# EAGLE design Bell003 (EAGLE 7.3.0)
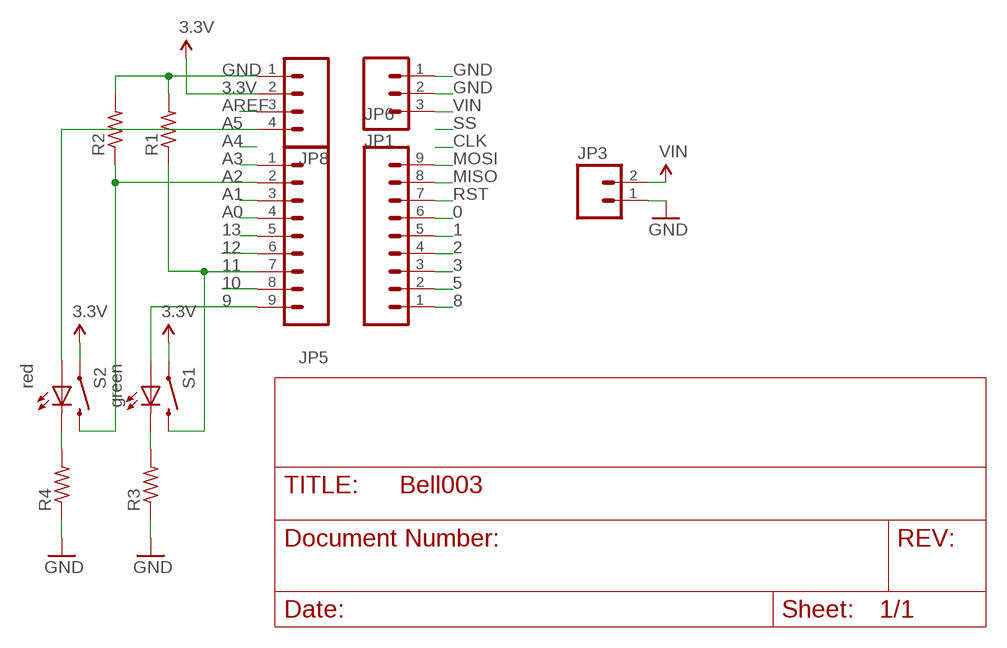
[diagram p0: schematic, sheet 1]

## Parts
JP1  M03PTH  [1X03]
JP3  M02-JST-2-PTH-NO_SILK  [JST-2-PTH-NS]
JP5  M09  [1X09]
JP6  M09  [1X09]
JP8  M04PTH  [1X04]
R1  RES-US1206FAB  [R1206FAB]
R2  RES-US1206FAB  [R1206FAB]
R3  RES-US1206FAB  [R1206FAB]
R4  RES-US1206FAB  [R1206FAB]
S1  green  SWITCH-MOMENTARY-LEDPTH  [TACTILE-PTH-LED-12MM]
S2  red  SWITCH-MOMENTARY-LEDPTH  [TACTILE-PTH-LED-12MM]

## Nets
0: JP6.6
1: JP6.5
2: JP6.4
3: JP6.3
3.3V: JP8.2 S1.4 S2.4
5: JP6.2
8: JP6.1
9: JP5.9 S1.A
10: JP5.8
11: JP5.7 R1.1 S1.2
12: JP5.6
13: JP5.5
A0: JP5.4
A1: JP5.3
A2: JP5.2 R2.1 S2.2
A3: JP5.1
A5: JP8.4 S2.A
AREF: JP8.3
GND: JP1.1 JP1.2 JP3.1 JP8.1 R1.2 R2.2 R3.1 R4.1
MISO: JP6.8
MOSI: JP6.9
N$4: R3.2 S1.C
N$5: R4.2 S2.C
RST: JP6.7
VIN: JP1.3 JP3.2

## Library data of the parts
JP1 = SparkFun-Connectors:M03: Header 3 Standard 3-pin 0.1" header. Use with straight break away headers (SKU : PRT-00116), right angle break away headers (PRT-00553), swiss pins (PRT-00743), machine pins (PRT-00117), and female headers (PRT-00115). Molex polarized connector foot print use with SKU : PRT-08232 with associated crimp pins and housings.
JP3 = SparkFun-Connectors:M02: Standard 2-pin 0.1" header. Use with - straight break away headers ( PRT-00116) - right angle break away headers (PRT-00553) - swiss pins (PRT-00743) - machine pins (PRT-00117) - female headers (PRT-00115) Molex polarized connector foot print use with: PRT-08233 with associated crimp pins and housings. 2.54_SCREWTERM for use with PRT-10571. 3.5mm Screw Terminal footprints for PRT-08084 5mm Screw Terminal footprints for use with PRT-08432
JP5 JP6 = SparkFun-Connectors:M09: Header 9 Standard 9-pin 0.1" header. Use with straight break away headers (SKU : PRT-00116), right angle break away headers (PRT-00553), swiss pins (PRT-00743), machine pins (PRT-00117), and female headers (PRT-00115).
JP8 = SparkFun-Connectors:M04: Header 4 Standard 4-pin 0.1" header. Use with straight break away headers (SKU : PRT-00116), right angle break away headers (PRT-00553), swiss pins (PRT-00743), machine pins (PRT-00117), and female headers (PRT-00115). Molex polarized connector foot print use with SKU : PRT-08231 with associated crimp pins and housings. 1MM SMD Version SKU: PRT-10208
R1-R4 = fab:RES-US: Resistor (US Symbol) Variants with postfix FAB are widened to allow the routing of internal traces
S1 S2 = SparkFun-Electromechanical:SWITCH-MOMENTARY-LED: EZ is for Kits. There is no tStop (covering up the top side of the pads with mask). This helps the beginner see which side they should be soldering too.

## Board
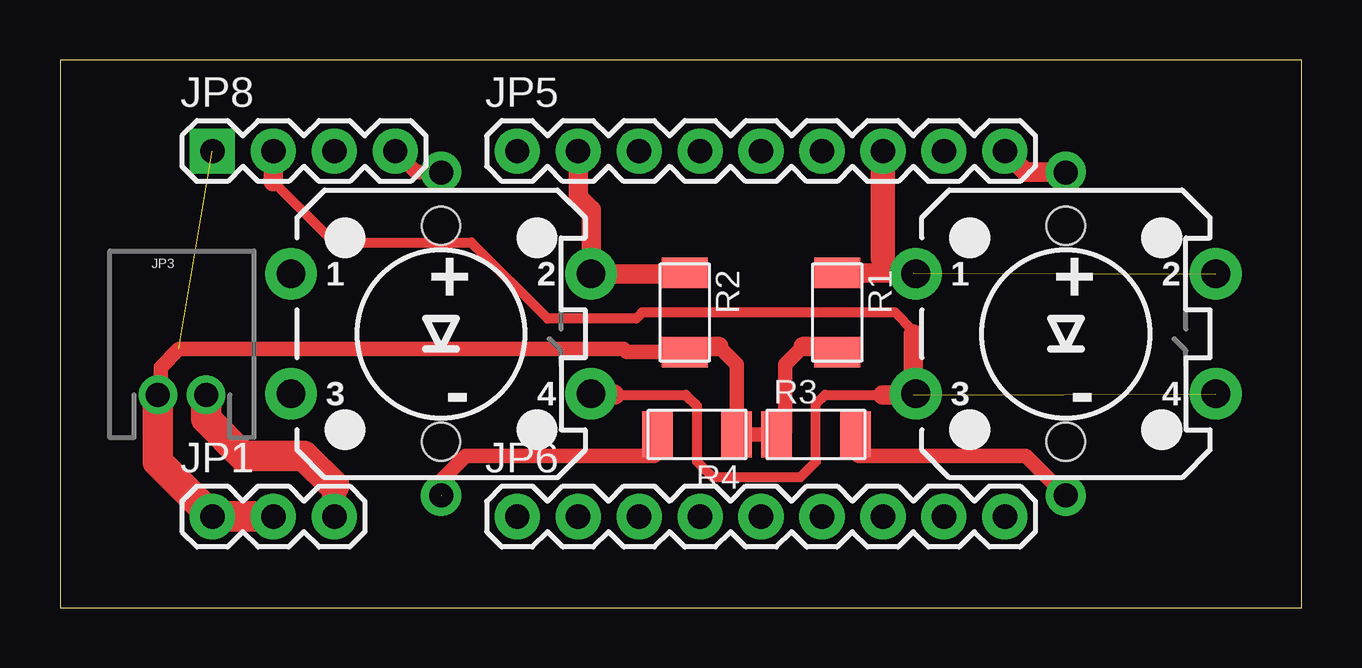
[diagram p1: board, top side]

Size 51.74 x 22.85 mm. Coordinates in mm from the lower left corner, seen from the top.
Outline: 0,0 51.74,0 51.74,22.85 0,22.85 0,0
Copper layers (1*16): Top 0.035mm / dielectric 1.5mm / Bottom 0.035mm
Design rules "fabmodule": minimum track width 10mil, minimum drill 0.4mm, track to track 0.42mm, track to pad 0.42mm, pad to pad 0.42mm, via to via 0.42mm, smd to smd 0.42mm, copper to edge 40mil, drill to drill 0.8mm, minimum pad ring 10mil, minimum via ring 8mil, stop-mask expansion 4mil, vias tented up to drill 0mil, thermal gap 10mil

### Footprints (pad centres in the part's own frame; a part is rotated, then mirrored left to right if it is on the bottom)
1X03 = drill 1.016 pad 1.88: 1 0,0; 2 2.54,0; 3 5.08,0
JST-2-PTH-NS = drill 0.7 pad 1.6: 1 -1,0; 2 1,0
1X09 = drill 1.016 pad 1.88: 1 0,0; 2 2.54,0; 3 5.08,0; 4 7.62,0; 5 10.16,0; 6 12.7,0; 7 15.24,0; 8 17.78,0; 9 20.32,0
1X04 = drill 1.016 pad 1.88 square: 1 0,0 | drill 1.016 pad 1.88: 2 2.54,0; 3 5.08,0; 4 7.62,0
R1206FAB = smd 1.27 x 1.905: 1 -1.651,0; 2 1.651,0
TACTILE-PTH-LED-12MM = drill 1.2 pad 2.159: 1 -6.25,2.5; 2 6.25,2.5; 3 -6.25,-2.5; 4 6.25,-2.5 | drill 0.8 pad 1.676: A 0,6.75; C 0,-6.75 | hole 1.6: 0,4.5; 0,-4.5

### Placement (x,y rotation side)
JP1  6.35,3.81 0 top
JP3  5.08,8.89 0 top
JP5  19.05,19.05 0 top
JP6  19.05,3.81 0 top
JP8  6.35,19.05 0 top
R1  32.38,12.32 270 top
R2  26.03,12.32 270 top
R3  31.5,7.24 0 top
R4  26.54,7.24 180 top
S1  41.91,11.43 0 top
S2  15.88,11.43 0 top

### Tracks (layer width: path | path; a pad name or v marks a point on that pad's centre or on a via)
3.3V  (1 unrouted)
  Top 0.406: 8.89,17.78 11.43,15.24 17.14,15.24 20.32,12.06 24,12.06 24.26,12.32 34.8,12.32 35.56,11.56 35.56,11.43 | 34.29,8.89 31.88,8.89 31.5,8.51 31.5,6.1 30.86,5.46 27.18,5.46 26.54,6.1 26.54,8.43 26.08,8.89 23.11,8.89
  Top 0.813: 35.56,11.43 35.56,8.89 34.29,8.89 | S2.4 23.07,8.93 23.11,8.89 | JP8.2 8.89,17.78
9
  Top 0.813: S1.A 40.24,18.18 JP5.9
11  (1 unrouted)
  Top 0.813: 35.56,13.97 34.29,13.97 | 34.29,13.97 31.98,13.97 R1.1 | 34.29,14.6 34.29,13.97
  Top 1.016: JP5.7 34.29,14.6
A2
  Top 0.813: R2.1 25.21,13.93 S2.2 22.12,16.61 21.59,17.15 JP5.2
A5
  Top 0.61: JP8.4 14.84,18.18 S2.A
GND  (1 unrouted)
  Top 0.61: 28.58,7.24 R3.1 30.23,7.39 30.23,10.16 30.96,10.9 | 28.58,7.24 R4.1 | 27.46,10.9 28.19,10.16 28.19,7.62 28.58,7.24 | JP3.1 4.19,9 4.19,10.03 4.95,10.79 23.49,10.79 23.62,10.67 R2.2
  Top 0.813: 27.46,10.9 26.26,10.9 R2.2 | 30.96,10.9 32.16,10.9 R1.2
  Top 1.27: JP3.1 4.08,6.08 JP1.1 JP1.2
N$2  (via drill 1)
  other vias: 4.06,8.89
N$3  (via drill 1)
  other vias: 6.1,8.89
N$4
  Top 0.406: 33.27,6.35 33.27,6.88 R3.2
  Top 0.61: S1.C 40.24,6.35 33.27,6.35 | 33.02,7.14 R3.2
N$5  (via drill 1)  (1 unrouted)
  Top 0.406: 24.77,6.35 24.77,6.88 R4.2
  Top 0.61: 24.77,6.35 16.91,6.35 15.88,5.31 v15.88,4.7
N$6  (via drill 1)
  other vias: 15.88,18.16
N$7  (via drill 1)
  other vias: 41.91,18.16
N$8  (via drill 1)
  other vias: 41.91,4.7
VIN
  Top 1.016: JP1.3 11.43,5.08
  Top 1.27: 11.43,5.08 10.16,6.35 7.62,6.35 6.1,7.87 6.1,8.87 JP3.2